# Altium schematic sheet sensor.schDoc: CJ125 Breakout
size A4; SheetNumber: 2; SheetTotal: 2
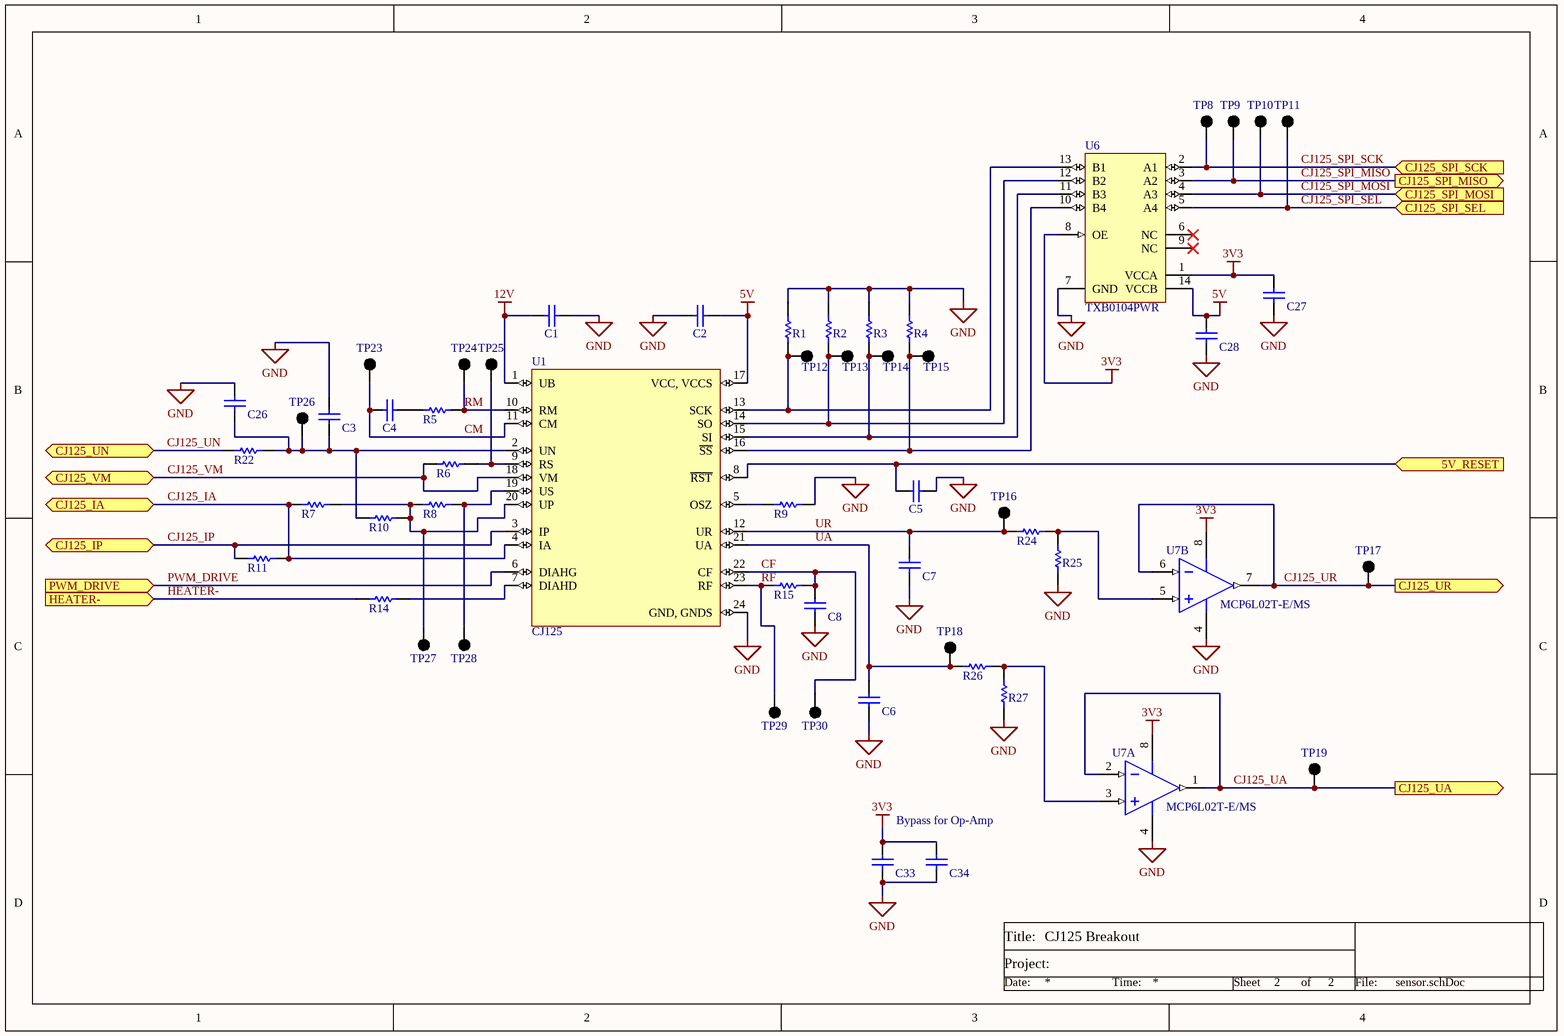
[diagram p0: sensor.schDoc]

## Parts
C1  Generic 0805 Capacitor  [0805]  (value not drawn)
C2  Generic 0805 Capacitor  [0805]  (value not drawn)
C3  Generic 0805 Capacitor  [0805]  (value not drawn)
C4  Generic 0805 Capacitor  [0805]  (value not drawn)
C5  Generic 0805 Capacitor  [0805]  (value not drawn)
C6  Generic 0805 Capacitor  [0805]  (value not drawn)
C7  Generic 0805 Capacitor  [0805]  (value not drawn)
C8  Generic 0805 Capacitor  [0805]  (value not drawn)
C26  Generic 0805 Capacitor  [0805]  (value not drawn)
C27  Generic 0805 Capacitor  [0805]  (value not drawn)
C28  Generic 0805 Capacitor  [0805]  (value not drawn)
C33  Generic 0805 Capacitor  [0805]  (value not drawn)
C34  Generic 0805 Capacitor  [0805]  (value not drawn)
R1  Generic 0603 Resistor  [0603]  (value not drawn)
R2  Generic 0603 Resistor  [0603]  (value not drawn)
R3  Generic 0603 Resistor  [0603]  (value not drawn)
R4  Generic 0603 Resistor  [0603]  (value not drawn)
R5  Generic 0603 Resistor  [0603]  (value not drawn)
R6  Generic 0603 Resistor  [0603]  (value not drawn)
R7  Generic 0603 Resistor  [0603]  (value not drawn)
R8  Generic 0603 Resistor  [0603]  (value not drawn)
R9  Generic 0603 Resistor  [0603]  (value not drawn)
R10  Generic 0603 Resistor  [0603]  (value not drawn)
R11  Generic 0603 Resistor  [0603]  (value not drawn)
R14  Generic 0603 Resistor  [0603]  (value not drawn)
R15  Generic 0603 Resistor  [0603]  (value not drawn)
R22  Generic 0603 Resistor  [0603]  (value not drawn)
R24  Generic 0603 Resistor  [0603]  (value not drawn)
R25  Generic 0603 Resistor  [0603]  (value not drawn)
R26  Generic 0603 Resistor  [0603]  (value not drawn)
R27  Generic 0603 Resistor  [0603]  (value not drawn)
TP8  5001  [KSTN-5001]  (value not drawn)
TP9  5001  [KSTN-5001]  (value not drawn)
TP10  5001  [KSTN-5001]  (value not drawn)
TP11  5001  [KSTN-5001]  (value not drawn)
TP12  5001  [KSTN-5001]  (value not drawn)
TP13  5001  [KSTN-5001]  (value not drawn)
TP14  5001  [KSTN-5001]  (value not drawn)
TP15  5001  [KSTN-5001]  (value not drawn)
TP16  5001  [KSTN-5001]  (value not drawn)
TP17  5001  [KSTN-5001]  (value not drawn)
TP18  5001  [KSTN-5001]  (value not drawn)
TP19  5001  [KSTN-5001]  (value not drawn)
TP23  5001  [KSTN-5001]  (value not drawn)
TP24  5001  [KSTN-5001]  (value not drawn)
TP25  5001  [KSTN-5001]  (value not drawn)
TP26  5001  [KSTN-5001]  (value not drawn)
TP27  5001  [KSTN-5001]  (value not drawn)
TP28  5001  [KSTN-5001]  (value not drawn)
TP29  5001  [KSTN-5001]  (value not drawn)
TP30  5001  [KSTN-5001]  (value not drawn)
U1  CJ125  [SOIC-24]
U6  TXB0104PWR  [PW0014A_M]
U7  MCP6L02T-E/MS  [MSOP8_M]  (parts A,B of 2)

## Ports
5V_RESET (in), CJ125_IA (bidir), CJ125_IP (bidir), CJ125_SPI_MISO (out), CJ125_SPI_MOSI (in), CJ125_SPI_SCK (in), CJ125_SPI_SEL (in), CJ125_UA (out), CJ125_UN (bidir), CJ125_UR (out), CJ125_VM (bidir), HEATER- (in), PWM_DRIVE (in)

## Nets
3V3: C27.2 C33.2 C34.2 U6.1(VCCA) U6.8(OE) U7.8(VDD)
5V: C2.1 C28.2 U1.17(VCC,_VCCS) U6.14(VCCB)
12V: C1.2 U1.1(UB)
GND: C1.1 C2.2 C3.2 C5.2 C6.1 C7.1 C8.1 C26.2 C27.1 C28.1 C33.1 C34.1 R1.2 R2.2 R3.2 R4.2 R9.2 R25.1 R27.1 U1.24(GND,_GNDS) U6.7(GND) U7.4(VSS)
5V_RESET: C5.1 U1.8(~{RST}) ; port 5V_RESET
CF: C8.2 R15.2 TP30.1 U1.22(CF)
CJ125_IA: R7.1 R11.2 U1.4(IA) ; port CJ125_IA
CJ125_IP: R11.1 U1.3(IP) ; port CJ125_IP
CJ125_SPI_MISO: TP9.1 U6.3(A2) ; port CJ125_SPI_MISO
CJ125_SPI_MOSI: TP10.1 U6.4(A3) ; port CJ125_SPI_MOSI
CJ125_SPI_SCK: TP8.1 U6.2(A1) ; port CJ125_SPI_SCK
CJ125_SPI_SEL: TP11.1 U6.5(A4) ; port CJ125_SPI_SEL
CJ125_UA: TP19.1 U7.1(VOUTA) U7.2(VINA-) ; port CJ125_UA
CJ125_UN: R22.1 ; port CJ125_UN
CJ125_UR: TP17.1 U7.6(VINB-) U7.7(VOUTB) ; port CJ125_UR
CJ125_VM: R6.1 U1.18(VM) ; port CJ125_VM
CM: C4.1 TP23.1 U1.11(CM)
HEATER-: R14.1 ; port HEATER-
PWM_DRIVE: U1.6(DIAHG) ; port PWM_DRIVE
RF: R15.1 TP29.1 U1.23(RF)
RM: R5.2 TP24.1 U1.10(RM)
UA: C6.2 R26.1 TP18.1 U1.21(UA)
UR: C7.2 R24.1 TP16.1 U1.12(UR)
NetC3_1: C3.1 C26.1 R10.1 R22.2 TP26.1 U1.2(UN)
NetC4_2: C4.2 R5.1
NetR1_1: R1.1 TP12.1 U1.13(SCK) U6.13(B1)
NetR2_1: R2.1 TP13.1 U1.14(SO) U6.12(B2)
NetR3_1: R3.1 TP14.1 U1.15(SI) U6.11(B3)
NetR4_1: R4.1 TP15.1 U1.16(~{SS}) U6.10(B4)
NetR6_2: R6.2 TP25.1 U1.9(RS)
NetR7_2: R7.2 R8.1 R10.2 TP27.1 U1.20(UP)
NetR8_2: R8.2 TP28.1 U1.19(US)
NetR9_1: R9.1 U1.5(OSZ)
NetR14_2: R14.2 U1.7(DIAHD)
NetR24_2: R24.2 R25.2 U7.5(VINB+)
NetR26_2: R26.2 R27.2 U7.3(VINA+)

Not connected (* = marked no-connect by the designer): U6 6(NC)* 9(NC)*

## Notes on the sheet
- Bypass for Op-Amp
- Title:
- Project:
- Date:
- Time:
- Sheet
- of
- File:
- Title
- Size:
- E
- Number:
- Revision:

## Library data of the parts
C1-C8 C26-C28 C33 C34 = C_0805: Value: *; Specifications: *
R1-R11 R14 R15 R22 R24-R27 = R_0603: Value: *; Specifications: *
TP8-TP19 TP23-TP30 = TP5001: Test Point, Black, 1-Pin THD, RoHS, Bulk; Manufacturer: Keystone; Other Names: 5001K; Catalog Drawings: 5000Series; Alternate Color: 5004K-ND / -TESTPOINTPCMINI.040"DYELLOW / 5003K-ND / -TESTPOINTPCMINI.040"DORANGE / 5002K-ND / -TESTPOINTPCMINI.040"DWHITE / 5000K-ND / -TESTPOINTPCMINI.040"DRED; Kits: DKTGRS232C-KIT-ND / -TTLCONVERTER; Online Catalog: ColorCodedTestPoints; Datasheet URL: https://ciiva.com/datasheet-click-2917627?src=ciiva&sig=bd195616; Mounting Type: 0.040"(1.02mm)HoleDiameter; Family: TestPoints; RoHS Information: RoHSComplianceStatement; Datasheet Version: Rev. G, 12/2008; Color: Black; Category: TestandMeasurement; Standard Package: 100; Manufacturer URL: http://www.keyelco.com/; Material: Base,Nylon46,UL94V-0; Type: PCTestPoint,Miniature; Terminal: 0.010"x0.020"(0.25mmx0.51mm)PhosphorBronzeWire,SilverPlated; Series: THM; Packaging: Bulk
U1 = CJ125: 5V 2Mbaud SMT Lambda Probe Interface IC - SOIC-24; Supplier 1: Future Electronics; Package Reference: SOIC-24; Supplier Part Number 1: 0272240104
U6 = TXB0104: 4-Bit Bidirectional Voltage-Level Translator with Automatic Direction Sensing and +/- 15-kV ESD Protection, -40 to 85 degC, 14-Pin TSSOP (PW), Green (RoHS & Sb/Br), Tape and Reel; Manufacturer: Texas Instruments; Dynamic Catalog: TXBSeries; Number of Bits: 4; Voltage - Supply: 1.2V~3.6V,1.65V~5.5V; Other Names: 296-21929-6; Propagation Delay (Max): 4ns; Logic Function: Translator,Bidirectional; Data Rate: 100Mbps; Differential - Input: Output:No/No; Number of Outputs/Channel: 1; Output Type: Logic; Product Training Modules: VoltageLevelTranslation; Number of Channels: 4; Package Reference: PW14; Package Description: 14-Pin Thin Shrink Small Outline Package, Body 5 x 4.4 mm, Pitch 0.65 mm; Datasheet Version: Rev. G, 11/2014; Manufacturer URL: http://www.ti.com/; Series: -; Packaging: Digi-Reel®; Mounting Technology: SurfaceMount; Family: Logic-Translators; Standard Package: 1; Category: IntegratedCircuits(ICs); Supplier Device Package: 14-TSSOP; Datasheet URL: http://www.ti.com/general/docs/lit/getliterature.tsp?genericPartNumber=TXB0104&fileType=pdf; Operating Temperature: -40°C~85°C; Input Type: Logic; Package / Case: 14-TSSOP(0.173",4.40mmWidth)
U7 = MCP6L02: 1 MHz, 85 Î¼A Dual Op Amp, 8-Pin MSOP, Extended Temperature Range, Tape and Reel; ComponentLink2URL: http://ww1.microchip.com/downloads/en/DeviceDoc/22140b.pdf; PackageDescription: 8-Lead Plastic Micro Small Outline Package (MS) [MSOP]; ComponentLink1URL: http://www.microchip.com/; ComponentLink1Description: Manufacturer URL; RevisionNote: URLs added. DatasheetVersion updated.; PackageVersion: revBB, Aug-2009; ComponentLink3URL: http://www.microchip.com/stellent/groups/techpub_sg/documents/packagingspec/en012702.pdf; ComponentLink2Description: Datasheet; ComponentLink3Description: Package Specification; DatasheetVersion: revB, Sep-2011; PackageReference: MSOP-MS8